# EAGLE design iGlass v1 (EAGLE 9.6.2)
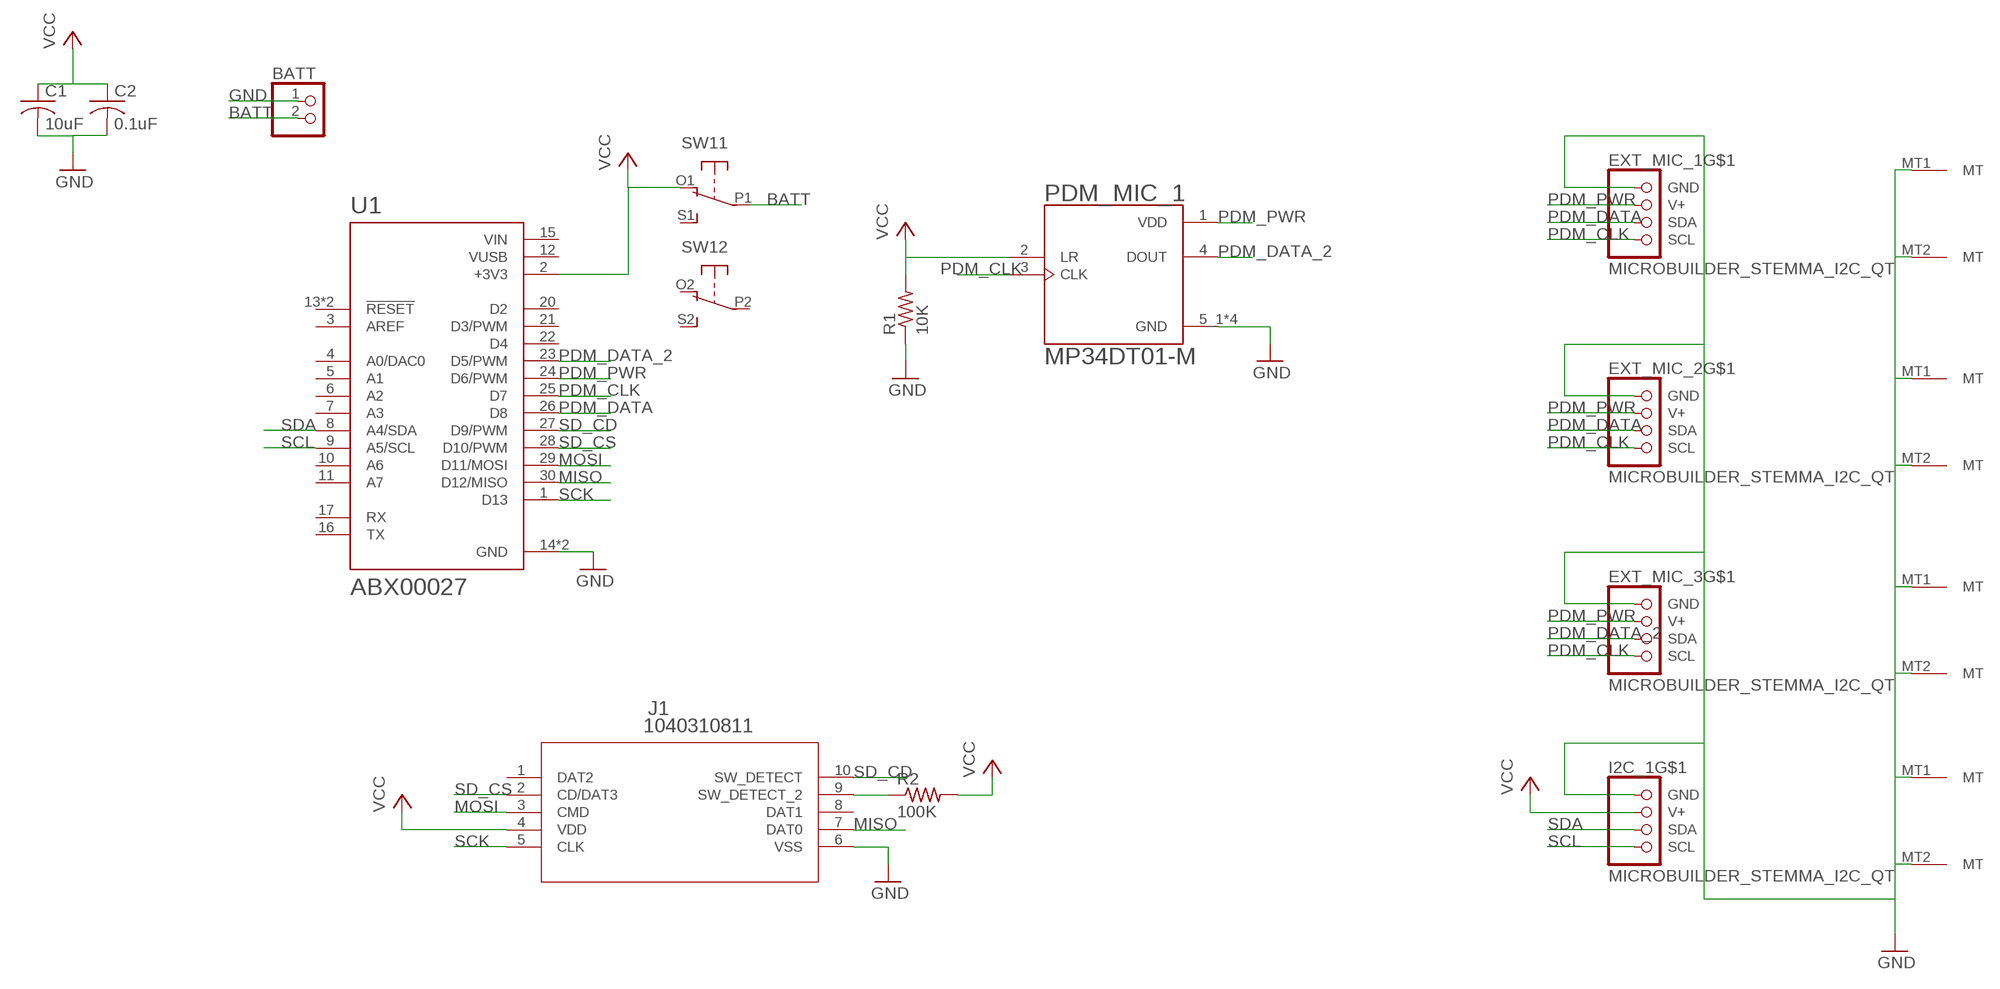
[diagram p0: schematic, sheet 1]

## Parts
BATT  CON_JST_PH_2PIN  [JSTPH2]
C1  10uF  C-USC0805  [C0805]
C2  0.1uF  C-USC0805  [C0805]
EXT_MIC_1  MICROBUILDER_STEMMA_I2C_QT  [MICROBUILDER_JST_SH4]
EXT_MIC_2  MICROBUILDER_STEMMA_I2C_QT  [MICROBUILDER_JST_SH4]
EXT_MIC_3  MICROBUILDER_STEMMA_I2C_QT  [MICROBUILDER_JST_SH4]
I2C_1  MICROBUILDER_STEMMA_I2C_QT  [MICROBUILDER_JST_SH4]
J1  1040310811  [104031-0811_MOL]
PDM_MIC_1  MP34DT01-M  [MIC_MP34DT01-M]
R1  10K  R-US_R0805  [R0805]
R2  100K  R-US_R0805  [R0805]
SW1  DPDT-EG1390  [EG1390]
U1  ABX00027  [MODULE_ABX00027]

## Nets
BATT: BATT.2 SW1.P1(1:P)
GND: BATT.1 C1.2 C2.2 EXT_MIC_1.1(GND) EXT_MIC_1.MT1(MT) EXT_MIC_1.MT2(MT) EXT_MIC_2.1(GND) EXT_MIC_2.MT1(MT) EXT_MIC_2.MT2(MT) EXT_MIC_3.1(GND) EXT_MIC_3.MT1(MT) EXT_MIC_3.MT2(MT) I2C_1.1(GND) I2C_1.MT1(MT) I2C_1.MT2(MT) J1.6(VSS) PDM_MIC_1.5_1(GND) PDM_MIC_1.5_2(GND) PDM_MIC_1.5_3(GND) PDM_MIC_1.5_4(GND) R1.1 U1.14(GND) U1.19(GND)
MISO: J1.7(DAT0) U1.30(D12/MISO)
MOSI: J1.3(CMD) U1.29(D11/MOSI)
N$3: J1.9(SW_DETECT_2) R2.1
PDM_CLK: EXT_MIC_1.4(SCL) EXT_MIC_2.4(SCL) EXT_MIC_3.4(SCL) PDM_MIC_1.3(CLK) U1.25(D7)
PDM_DATA: EXT_MIC_1.3(SDA) EXT_MIC_2.3(SDA) U1.26(D8)
PDM_DATA_2: EXT_MIC_3.3(SDA) PDM_MIC_1.4(DOUT) U1.23(D5/PWM)
PDM_PWR: EXT_MIC_1.2(V+) EXT_MIC_2.2(V+) EXT_MIC_3.2(V+) PDM_MIC_1.1(VDD) U1.24(D6/PWM)
SCK: J1.5(CLK) U1.1(D13)
SCL: I2C_1.4(SCL) U1.9(A5/SCL)
SD_CD: J1.10(SW_DETECT) U1.27(D9/PWM)
SD_CS: J1.2(CD/DAT3) U1.28(D10/PWM)
SDA: I2C_1.3(SDA) U1.8(A4/SDA)
VCC: C1.1 C2.1 I2C_1.2(V+) J1.4(VDD) PDM_MIC_1.2(LR) R1.2 R2.2 SW1.O1(1:O) U1.2(+3V3)
Unconnected: J1.1(DAT2) J1.8(DAT1) SW1.O2(2:O) SW1.P2(2:P) SW1.S1(1:S) SW1.S2(2:S) U1.3(AREF) U1.4(A0/DAC0) U1.5(A1) U1.6(A2) U1.7(A3) U1.10(A6) U1.11(A7) U1.13(!RESET) U1.16(TX) U1.17(RX) U1.18(!RESET) U1.20(D2) U1.21(D3/PWM) U1.22(D4)

## Power pins joined to a net without a drawn wire
VIN: U1.15(VIN)
VUSB: U1.12(VUSB)

## Library data of the parts
BATT = microbuilder:CON_JST_PH_2PIN: JST 2-Pin Right-Angle Connector PH-Series - 4UConnector: 17311 SH-Series - 4UConnector: 07278
C1 C2 = rcl:C-US: CAPACITOR, American symbol
EXT_MIC_1-EXT_MIC_3 I2C_1 = smart-glasses:MICROBUILDER_STEMMA_I2C
J1 = micro_sd_slot:1040310811; COPYRIGHT: Copyright (C) 2021 Ultra Librarian. All rights reserved.; MANUFACTURER_PART_NUMBER: 1040310811; MFR_NAME: Molex Connector Corporation
PDM_MIC_1 = MP34DT01-M:MP34DT01-M: MEMS audio sensor omnidirectional stereo digital microphone Check prices <https://pricing.snapeda.com/parts/MP34DT01-M/STMicroelectronics/view-part?ref=eda>; AVAILABILITY: Not in stock; DESCRIPTION: MP34DT01-M Microphone Audio Nucleo Platform Evaluation Expansion Board; MF: STMicroelectronics; MP: MP34DT01-M; PACKAGE: None; PRICE: None
R1 R2 = resistor:R-US_: RESISTOR, American symbol
SW1 = adafruit2:DPDT
U1 = ABX00027:ABX00027: ATSAMD21G18A Arduino Nano 33 IoT SAM D ARM® Cortex®-M0+ MCU 32-Bit Embedded Evaluation Board Check prices <https://pricing.snapeda.com/parts/ABX00027/Arduino/view-part?ref=eda>; AVAILABILITY: In Stock; DESCRIPTION: ATSAMD21G18A Arduino Nano 33 IoT SAM D ARM® Cortex®-M0+ MCU 32-Bit Embedded Evaluation Board; MF: Arduino; MP: ABX00027; PACKAGE: None; PRICE: None; PURCHASE-URL: https://pricing.snapeda.com/search/part/ABX00027/?ref=eda

## Board
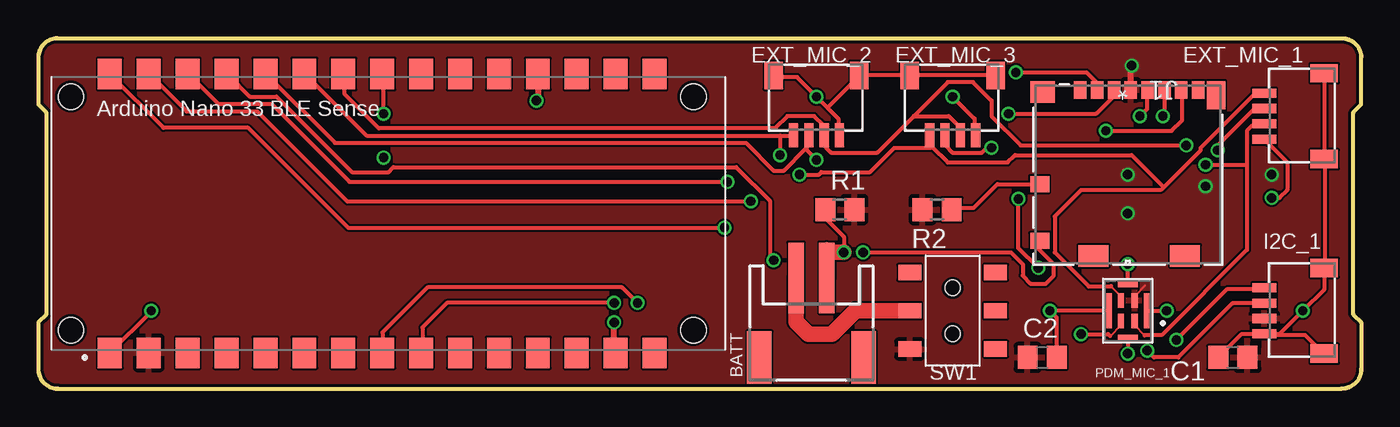
[diagram p1: board, top side]
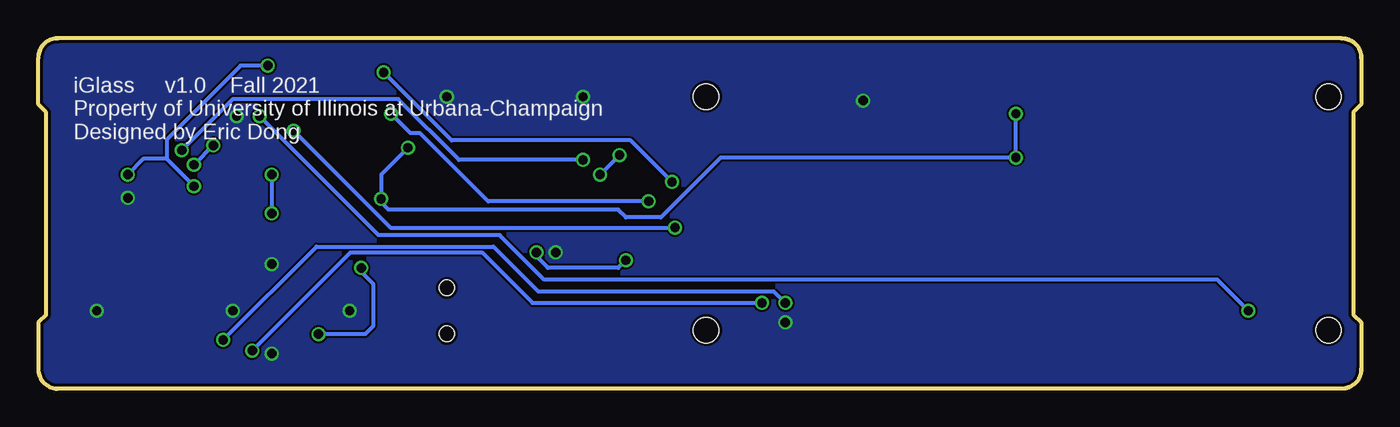
[diagram p2: board, bottom side, seen from below]

Size 86.36 x 22.86 mm. Coordinates in mm from the lower left corner, seen from the top.
Outline: 1.27,22.86 arc90 0,21.59 0,18.54 0.51,18.03 0.51,4.83 0,4.32 0,1.27 arc90 1.27,0 85.09,0 arc90 86.36,1.27 86.36,4.32 85.85,4.83 85.85,18.03 86.36,18.54 86.36,21.59 arc90 85.09,22.86 1.27,22.86
Copper layers (1*16): Top 0.035559375mm / dielectric 1.6mm / Bottom 0.035559375mm
Design rules "jlcpcb2layer": minimum track width 5mil, minimum drill 12mil, track to track 5mil, track to pad 5mil, pad to pad 5mil, via to via 5mil, smd to smd 5mil, copper to edge 8mil, drill to drill 6mil, minimum pad ring 5mil, minimum via ring 3mil, stop-mask expansion 2.5mil, vias tented up to drill 0mil, thermal gap 10mil

### Footprints (pad centres in the part's own frame; a part is rotated, then mirrored left to right if it is on the bottom)
JSTPH2 = smd 1 x 4.6: 1 -1,-3.7; 2 1,-3.7 | smd 1.6 x 3.4: NC1 -3.4,1.5; NC2 3.4,1.5
C0805 = smd 1.3 x 1.5: 1 -0.95,0; 2 0.95,0
MICROBUILDER_JST_SH4 = smd 0.6 x 1.55: 1 -1.5,2.514; 2 -0.5,2.514; 3 0.5,2.514; 4 1.5,2.514 | smd 1.2 x 1.8: MT1 -2.8,-1.386; MT2 2.8,-1.386
104031-0811_MOL = smd 0.813 x 1.143: 1 3.105,-5.521; 2 2.005,-5.521; 3 0.905,-5.521; 4 -0.195,-5.521; 5 -1.295,-5.521; 6 -2.395,-5.521; 7 -3.495,-5.521; 8 -4.595,-5.521 | smd 1.245 x 1.041: 9 5.74,0.628; 10 5.74,4.329 | smd 1.6 x 1.397: 11 5.565,-5.396 | smd 1.219 x 1.854: 12 -5.755,-5.171 | smd 1.956 x 1.397: 13 -3.73,5.303; 14 2.24,5.303
MIC_MP34DT01-M = smd 0.4 x 0.95: 1 -0.45,0.675; 2 -0.45,-0.675; 3 0.45,-0.675; 4 0.45,0.675 | smd 1.3 x 0.35: 5_1 0,1.725; 5_3 0,-1.725 | smd 0.35 x 2.3: 5_2 1.225,0; 5_4 -1.225,0
R0805 = smd 1.3 x 1.5: 1 -0.95,0; 2 0.95,0
EG1390 = smd 1 x 1.5: O1 -2.5,2.8; O2 -2.5,-2.8; P1 0,2.8; P2 0,-2.8; S1 2.5,2.8; S2 2.5,-2.8 | hole 1: 1.5,0; -1.5,0
MODULE_ABX00027 = smd 1.56 x 2: 1 -18.19,-9.1; 2 -15.65,-9.1; 3 -13.11,-9.1; 4 -10.57,-9.1; 5 -8.03,-9.1; 6 -5.49,-9.1; 7 -2.95,-9.1; 8 -0.41,-9.1; 9 2.13,-9.1; 10 4.67,-9.1; 11 7.21,-9.1; 12 9.75,-9.1; 13 12.29,-9.1; 14 14.83,-9.1; 15 17.37,-9.1; 16 17.37,9.1; 17 14.83,9.1; 18 12.29,9.1; 19 9.75,9.1; 20 7.21,9.1; 21 4.67,9.1; 22 2.13,9.1; 23 -0.41,9.1; 24 -2.95,9.1; 25 -5.49,9.1; 26 -8.03,9.1; 27 -10.57,9.1; 28 -13.11,9.1; 29 -15.65,9.1; 30 -18.19,9.1 | hole 1.651: -20.73,-7.62; -20.73,7.62; 19.91,7.62; 19.91,-7.62

### Placement (x,y rotation side)
BATT  50.47,3.53 180 top
C1  77.98,2.03 180 top
C2  65.53,2.03 0 top
EXT_MIC_1  82.55,17.78 90 top
EXT_MIC_2  50.8,19.05 180 top
EXT_MIC_3  59.69,19.05 180 top
I2C_1  82.55,5.08 90 top
J1  71.12,13.97 180 top
PDM_MIC_1  71.12,5.08 180 top
R1  52.32,11.68 0 top
R2  58.67,11.68 180 top
SW1  59.69,5.08 90 top
U1  22.86,11.43 0 top

### Tracks (layer width: path | path; a pad name or v marks a point on that pad's centre or on a via)
BATT
  Top 1.016: BATT.2 49.47,4.38 50.29,3.56 51.82,3.56 53.34,5.08 SW1.P1
GND  (via drill 0.61)
  Top 0.254: PDM_MIC_1.5_1 v71.12,2.29 | PDM_MIC_1.5_4 v73.66,5.08 | PDM_MIC_1.5_3 v71.12,8.13 | PDM_MIC_1.5_2 v66.04,5.08 66.48,4.64 C2.2 | 83.82,20.48 EXT_MIC_1.MT2 EXT_MIC_1.MT1 83.98,14.92 | I2C_1.1 80.17,3.49 82.71,3.49 83.82,2.38 I2C_1.MT1 83.82,2.54 | 83.82,7.78 I2C_1.MT2 | 51.51,18.34 v50.8,19.05 49.53,20.32 48.1,20.32 EXT_MIC_2.MT2 | 51.51,18.34 52.23,17.62 52.23,16.67 EXT_MIC_2.1 | v59.69,19.05 61.12,17.62 61.12,16.67 EXT_MIC_3.1 | 80.17,16.35 EXT_MIC_1.1 81.53,14.78 81.53,12.95 81.03,12.45 v80.52,12.45 | 83.82,15.08 EXT_MIC_1.MT1 83.98,14.92 | 51.51,18.34 53.5,20.32 EXT_MIC_2.MT1 53.66,20.48 56.83,20.48 EXT_MIC_3.MT2 56.99,20.48 62.39,20.48 EXT_MIC_3.MT1 | 83.98,14.92 83.98,7.94 I2C_1.MT2 | J1.6 73.52,17.89 v73.41,17.78 | I2C_1.1 81.05,3.58 v82.55,5.08 83.94,6.47 I2C_1.MT2 | R1.1 51.37,11.11 52.58,9.91 v52.58,8.89 | C1.2 78.58,3.58 I2C_1.1
  Top 0.406: U1.14 37.59,2.43 v37.59,4.32 | U1.19 32.61,18.89 v32.51,18.8 | 51.47,9.36 51.47,8.89
  Top 1.016: BATT.1 51.47,8.89 v52.58,8.89
  pour Bottom: -1.27,24.13 87.63,24.13 87.63,-1.27 -1.27,-1.27
MISO  (via drill 0.61)
  Top 0.254: J1.7 74.61,19.37 74.68,19.3 74.68,17.53 73.98,16.83 v69.69,16.83 | v44.8,10.51 20.22,10.51 13.72,17.02 8.18,17.02 U1.30
  Bottom 0.254: v69.69,16.83 63.37,10.51 v44.8,10.51
MOSI  (via drill 0.61)
  Top 0.254: v63.34,17.94 69.06,17.94 70.17,19.05 70.17,19.37 J1.3 | v46.51,12.22 20.16,12.22 14.29,18.1 9.68,18.1 7.3,20.48 U1.29
  Bottom 0.254: v63.34,17.94 62.07,16.67 61.44,16.67 56.99,12.22 v46.51,12.22
N$3
  Top 0.254: J1.9 62.62,13.34 61.09,11.81 59.75,11.81 R2.1
PDM_CLK  (via drill 0.61)
  Top 0.127: 70.03,6.68 70.67,6.04 PDM_MIC_1.3
  Top 0.254: 58.34,15.8 58.26,15.88 58.26,16.51 EXT_MIC_3.4 | 58.34,15.8 59.37,14.76 63.28,14.76 63.75,15.24 71.37,15.24 73.47,13.14 | 70.03,6.68 70.01,6.67 68.58,6.67 66.36,8.89 66.36,11.24 68.07,12.95 73.28,12.95 73.47,13.14 | 73.47,13.14 75.88,15.56 75.88,15.72 79.38,19.21 80.01,19.21 EXT_MIC_1.4 | 48.42,16.51 21.43,16.51 17.46,20.48 U1.25 | 48.42,16.51 49.21,16.51 EXT_MIC_2.4 | v49.69,13.97 50.96,13.97 51.12,14.13 54.29,14.13 55.88,15.72 58.26,15.72 58.34,15.8 | 48.42,16.51 v48.42,15.24
  Bottom 0.254: v48.42,15.24 v49.69,13.97
PDM_DATA  (via drill 0.61)
  Top 0.254: 50.09,15.64 50.16,15.72 50.16,16.51 EXT_MIC_2.3 | U1.26 14.92,20.48 19.37,16.03 46.2,16.03 48.01,14.22 48.67,14.22 50.09,15.64 | v76.99,15.56 76.99,15.88 79.38,18.26 80.01,18.26 EXT_MIC_1.3 | 50.09,15.64 v50.8,14.92
  Bottom 0.254: v76.99,15.56 73.66,18.89 62.86,18.89 58.9,14.92 v50.8,14.92
PDM_DATA_2  (via drill 0.61)
  Top 0.127: 69.98,3.43 70.67,4.12 PDM_MIC_1.4
  Top 0.254: v62.23,15.72 61.91,15.72 61.59,15.4 59.69,15.4 59.21,15.88 59.21,16.51 EXT_MIC_3.3 | v22.54,17.94 22.54,20.48 U1.23 | v68.07,3.56 69.85,3.56 69.98,3.43 | v65.28,7.87 63.98,9.18 v63.98,12.38
  Bottom 0.254: v62.23,15.72 63.98,13.97 v63.98,12.38 63.98,12.16 63.5,11.68 48.51,11.68 48.01,11.18 45.72,11.18 41.81,15.08 v22.54,15.08 v22.54,17.94 | v68.07,3.56 65.02,3.56 64.52,4.06 64.52,6.86 65.28,7.62 v65.28,7.87
PDM_PWR  (via drill 0.61)
  Top 0.127: 72.22,3.48 71.57,4.12 PDM_MIC_1.1
  Top 0.254: 78.9,14.61 78.9,16.83 79.22,17.14 80.01,17.14 EXT_MIC_1.2 | 78.9,14.61 78.9,9.05 73.34,3.49 72.23,3.49 72.22,3.48 | U1.24 20,20.48 20,19.21 22.22,16.99 48.1,16.99 48.89,17.78 50.64,17.78 51.28,17.14 51.28,16.67 EXT_MIC_2.2 51.44,16.51 51.44,15.72 51.75,15.4 54.77,15.4 57.15,17.78 | v76.2,14.61 78.9,14.61 | v74.93,15.88 64.14,15.88 62.23,17.78 62.23,18.8 61.02,20 59.37,20 57.15,17.78 | 57.15,17.78 59.44,17.78 60.19,17.03 EXT_MIC_3.2
  Bottom 0.254: v74.93,15.88 v76.2,14.61
SCK  (via drill 0.61)
  Top 0.254: v71.91,17.78 72.39,18.26 72.39,19.37 J1.5 | U1.1 7.37,5.03 v7.37,5.08
  Bottom 0.254: v71.91,17.78 64.15,10.02 56.24,10.02 53.34,7.11 9.4,7.11 v7.37,5.08
SCL  (via drill 0.61)
  Top 0.254: v74.3,3.17 77.63,6.51 80.01,6.51 I2C_1.4 | U1.9 25.08,2.38 25.08,4 26.67,5.59 v37.59,5.59
  Bottom 0.254: v74.3,3.17 68.2,9.27 56.64,9.27 53.72,6.35 38.35,6.35 v37.59,5.59
SD_CD  (via drill 0.61)
  Top 0.254: J1.10 65.25,9.52 65.25,9.18 66.29,8.13 66.29,7.37 65.79,6.86 64.77,6.86 64.26,7.37 64.26,8.13 63.5,8.89 v53.85,8.89 | U1.27 12.38,20.48 13.81,19.05 15.56,19.05 20.48,14.13 22.86,14.13 23.18,14.45 45.56,14.45 47.75,12.26 47.75,8.64 v48.01,8.38
  Bottom 0.254: v48.01,8.38 48.51,7.87 53.09,7.87 53.85,8.64 v53.85,8.89
SD_CS  (via drill 0.61)
  Top 0.254: v63.82,20.64 68.42,20.64 69.06,20 69.06,19.53 J1.2 | v44.99,13.49 20.32,13.49 15.24,18.57 11.75,18.57 9.84,20.48 U1.28
  Bottom 0.254: v63.82,20.64 59.37,16.19 47.69,16.19 v44.99,13.49
SDA  (via drill 0.61)
  Top 0.254: I2C_1.3 80.01,5.56 77.95,5.56 74.42,2.03 72.83,2.03 v72.39,2.48 | U1.8 22.46,2.34 22.46,3.67 25.4,6.6 38.1,6.6 v39.12,5.59
  Bottom 0.254: v72.39,2.48 65.98,8.89 57.4,8.89 54.1,5.59 v39.12,5.59
VCC  (via drill 0.61)
  Top 0.127: 72.26,6.73 71.57,6.04
  Top 0.254: 70.87,14.22 v71.12,13.97
  Top 0.406: J1.4 71.31,21.08 v71.37,21.08
  Bottom 0.254: v71.37,21.08 73.15,21.08 77.98,16.26 77.98,14.99 | v76.2,13.21 77.98,14.99 | 77.98,14.99 79.5,14.99 v80.52,13.97 | v71.12,13.97 v71.12,11.43
  pour Top: -1.27,24.13 87.63,24.13 87.63,-1.27 -1.27,-1.27

### Text on the board
tPlace: Arduino Nano 33 BLE Sense
bPlace: iGlass v1.0 Fall 2021 / Property of University of Illinois at Urbana-Champaign / Designed by Eric Dong